# Altium schematic sheet LED_Monitor.SchDoc: LED Monitor
size Tabloid; Date: 12/20/2022; Engineer: Terry D. Schevker; Revision: 1.0; SheetNumber: 2; SheetTotal: 4
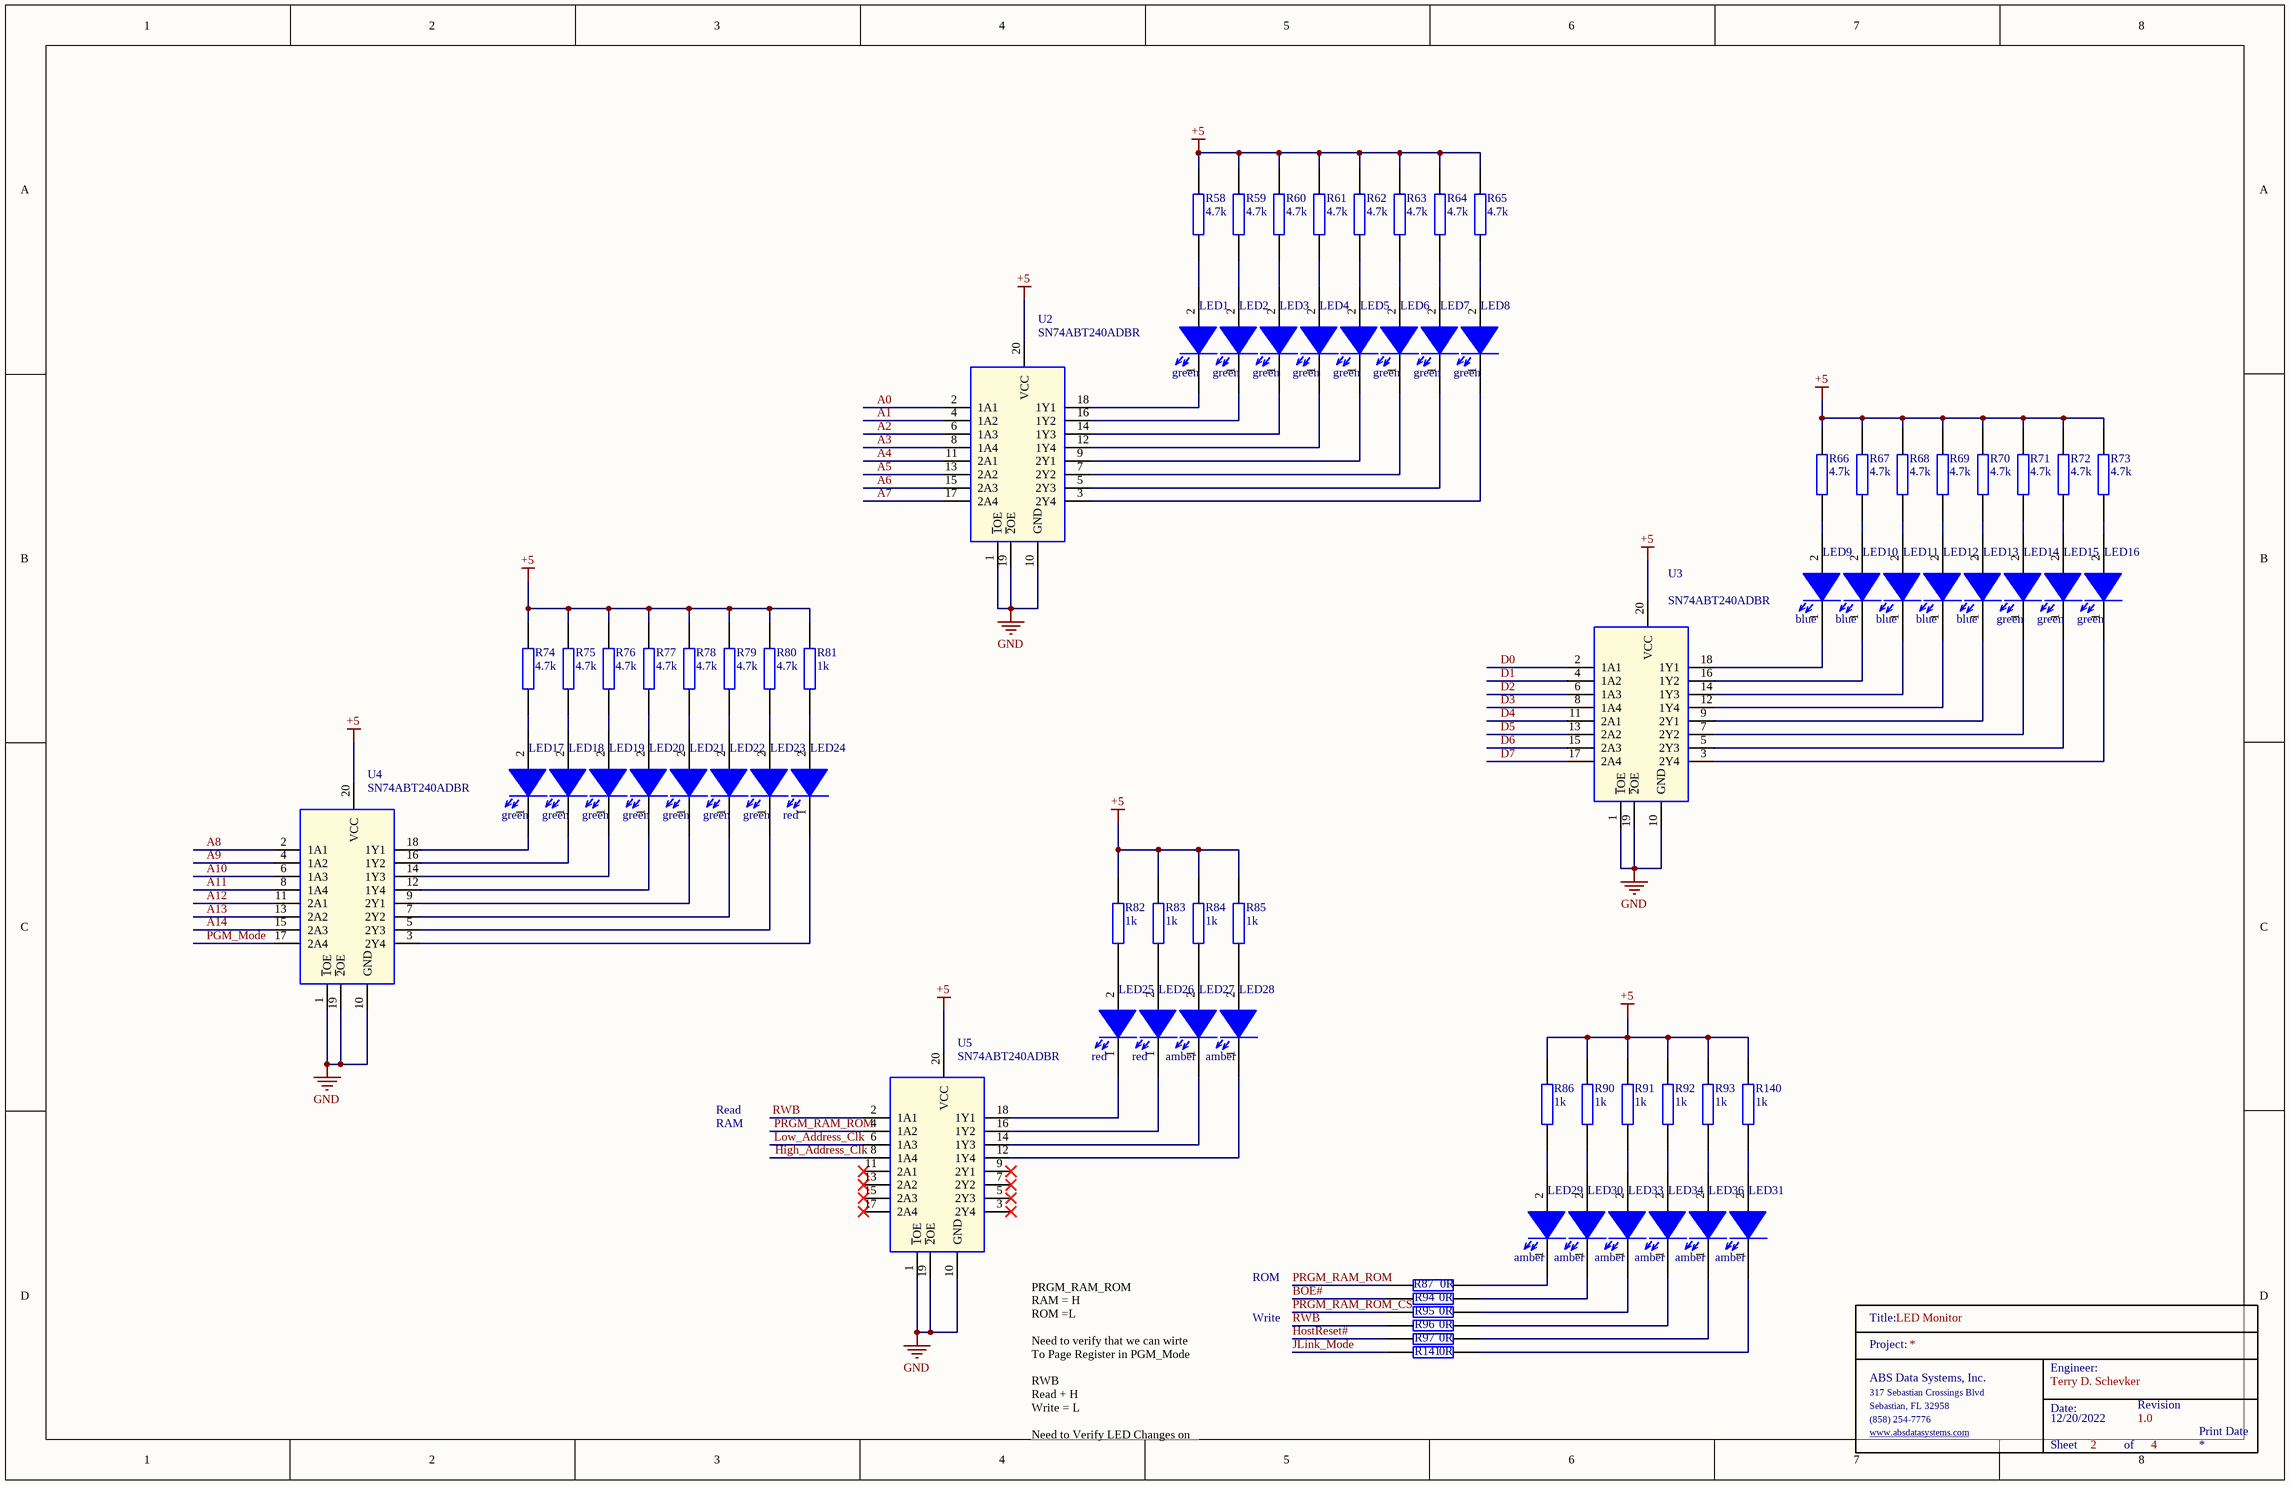
[diagram p0: LED_Monitor.SchDoc]

## Parts
LED1  green  [0603_Diode]
LED2  green  [0603_Diode]
LED3  green  [0603_Diode]
LED4  green  [0603_Diode]
LED5  green  [0603_Diode]
LED6  green  [0603_Diode]
LED7  green  [0603_Diode]
LED8  green  [0603_Diode]
LED9  blue  [0603_Diode]
LED10  blue  [0603_Diode]
LED11  blue  [0603_Diode]
LED12  blue  [0603_Diode]
LED13  blue  [0603_Diode]
LED14  green  [0603_Diode]
LED15  green  [0603_Diode]
LED16  green  [0603_Diode]
LED17  green  [0603_Diode]
LED18  green  [0603_Diode]
LED19  green  [0603_Diode]
LED20  green  [0603_Diode]
LED21  green  [0603_Diode]
LED22  green  [0603_Diode]
LED23  green  [0603_Diode]
LED24  red  [0603_Diode]
LED25  red  [0603_Diode]
LED26  red  [0603_Diode]
LED27  amber  [0603_Diode]
LED28  amber  [0603_Diode]
LED29  amber  [0603_Diode]
LED30  amber  [0603_Diode]
LED31  amber  [0603_Diode]
LED33  amber  [0603_Diode]
LED34  amber  [0603_Diode]
LED36  amber  [0603_Diode]
R58  4.7k  [0603]
R59  4.7k  [0603]
R60  4.7k  [0603]
R61  4.7k  [0603]
R62  4.7k  [0603]
R63  4.7k  [0603]
R64  4.7k  [0603]
R65  4.7k  [0603]
R66  4.7k  [0603]
R67  4.7k  [0603]
R68  4.7k  [0603]
R69  4.7k  [0603]
R70  4.7k  [0603]
R71  4.7k  [0603]
R72  4.7k  [0603]
R73  4.7k  [0603]
R74  4.7k  [0603]
R75  4.7k  [0603]
R76  4.7k  [0603]
R77  4.7k  [0603]
R78  4.7k  [0603]
R79  4.7k  [0603]
R80  4.7k  [0603]
R81  1k  [0603]
R82  1k  [0603]
R83  1k  [0603]
R84  1k  [0603]
R85  1k  [0603]
R86  1k  [0603]
R87  0R  [0603]
R90  1k  [0603]
R91  1k  [0603]
R92  1k  [0603]
R93  1k  [0603]
R94  0R  [0603]
R95  0R  [0603]
R96  0R  [0603]
R97  0R  [0603]
R140  1k  [0603]
R141  0R  [0603]
TitleBlock_1  TitleBlock  (value not drawn)  (graphical)
U2  SN74ABT240ADBR  [SOP65P780X200-20N]
U3  SN74ABT240ADBR  [SOP65P780X200-20N]
U4  SN74ABT240ADBR  [SOP65P780X200-20N]
U5  SN74ABT240ADBR  [SOP65P780X200-20N]

## Nets
+5: R58.2 R59.2 R60.2 R61.2 R62.2 R63.2 R64.2 R65.2 R66.2 R67.2 R68.2 R69.2 R70.2 R71.2 R72.2 R73.2 R74.2 R75.2 R76.2 R77.2 R78.2 R79.2 R80.2 R81.2 R82.2 R83.2 R84.2 R85.2 R86.2 R90.2 R91.2 R92.2 R93.2 R140.2 U2.20(VCC) U3.20(VCC) U4.20(VCC) U5.20(VCC)
GND: U2.1(~{1}OE) U2.10(GND) U2.19(~{2}OE) U3.1(~{1}OE) U3.10(GND) U3.19(~{2}OE) U4.1(~{1}OE) U4.10(GND) U4.19(~{2}OE) U5.1(~{1}OE) U5.10(GND) U5.19(~{2}OE)
A0: U2.2(1A1)
A1: U2.4(1A2)
A2: U2.6(1A3)
A3: U2.8(1A4)
A4: U2.11(2A1)
A5: U2.13(2A2)
A6: U2.15(2A3)
A7: U2.17(2A4)
A8: U4.2(1A1)
A9: U4.4(1A2)
A10: U4.6(1A3)
A11: U4.8(1A4)
A12: U4.11(2A1)
A13: U4.13(2A2)
A14: U4.15(2A3)
BOE#: R94.1
D0: U3.2(1A1)
D1: U3.4(1A2)
D2: U3.6(1A3)
D3: U3.8(1A4)
D4: U3.11(2A1)
D5: U3.13(2A2)
D6: U3.15(2A3)
D7: U3.17(2A4)
High_Address_Clk: U5.8(1A4)
HostReset#: R97.1
JLink_Mode: R141.1
Low_Address_Clk: U5.6(1A3)
PGM_Mode: U4.17(2A4)
PRGM_RAM_ROM: R87.1 U5.4(1A2)
PRGM_RAM_ROM_CS: R95.1
RWB: R96.1 U5.2(1A1)
NetLED1_1: LED1.1(K) U2.18(1Y1)
NetLED1_2: LED1.2(A) R58.1
NetLED2_1: LED2.1(K) U2.16(1Y2)
NetLED2_2: LED2.2(A) R59.1
NetLED3_1: LED3.1(K) U2.14(1Y3)
NetLED3_2: LED3.2(A) R60.1
NetLED4_1: LED4.1(K) U2.12(1Y4)
NetLED4_2: LED4.2(A) R61.1
NetLED5_1: LED5.1(K) U2.9(2Y1)
NetLED5_2: LED5.2(A) R62.1
NetLED6_1: LED6.1(K) U2.7(2Y2)
NetLED6_2: LED6.2(A) R63.1
NetLED7_1: LED7.1(K) U2.5(2Y3)
NetLED7_2: LED7.2(A) R64.1
NetLED8_1: LED8.1(K) U2.3(2Y4)
NetLED8_2: LED8.2(A) R65.1
NetLED9_1: LED9.1(K) U3.18(1Y1)
NetLED9_2: LED9.2(A) R66.1
NetLED10_1: LED10.1(K) U3.16(1Y2)
NetLED10_2: LED10.2(A) R67.1
NetLED11_1: LED11.1(K) U3.14(1Y3)
NetLED11_2: LED11.2(A) R68.1
NetLED12_1: LED12.1(K) U3.12(1Y4)
NetLED12_2: LED12.2(A) R69.1
NetLED13_1: LED13.1(K) U3.9(2Y1)
NetLED13_2: LED13.2(A) R70.1
NetLED14_1: LED14.1(K) U3.7(2Y2)
NetLED14_2: LED14.2(A) R71.1
NetLED15_1: LED15.1(K) U3.5(2Y3)
NetLED15_2: LED15.2(A) R72.1
NetLED16_1: LED16.1(K) U3.3(2Y4)
NetLED16_2: LED16.2(A) R73.1
NetLED17_1: LED17.1(K) U4.18(1Y1)
NetLED17_2: LED17.2(A) R74.1
NetLED18_1: LED18.1(K) U4.16(1Y2)
NetLED18_2: LED18.2(A) R75.1
NetLED19_1: LED19.1(K) U4.14(1Y3)
NetLED19_2: LED19.2(A) R76.1
NetLED20_1: LED20.1(K) U4.12(1Y4)
NetLED20_2: LED20.2(A) R77.1
NetLED21_1: LED21.1(K) U4.9(2Y1)
NetLED21_2: LED21.2(A) R78.1
NetLED22_1: LED22.1(K) U4.7(2Y2)
NetLED22_2: LED22.2(A) R79.1
NetLED23_1: LED23.1(K) U4.5(2Y3)
NetLED23_2: LED23.2(A) R80.1
NetLED24_1: LED24.1(K) U4.3(2Y4)
NetLED24_2: LED24.2(A) R81.1
NetLED25_1: LED25.1(K) U5.18(1Y1)
NetLED25_2: LED25.2(A) R82.1
NetLED26_1: LED26.1(K) U5.16(1Y2)
NetLED26_2: LED26.2(A) R83.1
NetLED27_1: LED27.1(K) U5.14(1Y3)
NetLED27_2: LED27.2(A) R84.1
NetLED28_1: LED28.1(K) U5.12(1Y4)
NetLED28_2: LED28.2(A) R85.1
NetLED29_1: LED29.1(K) R87.2
NetLED29_2: LED29.2(A) R86.1
NetLED30_1: LED30.1(K) R94.2
NetLED30_2: LED30.2(A) R90.1
NetLED31_1: LED31.1(K) R141.2
NetLED31_2: LED31.2(A) R140.1
NetLED33_1: LED33.1(K) R95.2
NetLED33_2: LED33.2(A) R91.1
NetLED34_1: LED34.1(K) R96.2
NetLED34_2: LED34.2(A) R92.1
NetLED36_1: LED36.1(K) R97.2
NetLED36_2: LED36.2(A) R93.1

Not connected (* = marked no-connect by the designer): U5 3(2Y4)* 5(2Y3)* 7(2Y2)* 9(2Y1)* 11(2A1)* 13(2A2)* 15(2A3)* 17(2A4)*

## Notes on the sheet
- RAM
- Read
- ROM
- Write
- PRGM_RAM_ROM
  RAM = H
  ROM =L
  Need to verify that we can wirte To Page Register in PGM_Mode
  RWB
  Read + H
  Write = L
  Need to Verify LED Changes on PCB
- Print Date
- (in symbol TitleBlock) Title:; Project:; Engineer:; ABS Data Systems, Inc.; 317 Sebastian Crossings Blvd; Sebastian, FL 32958; Date:; Revision; (858) 254-7776; www.absdatasystems.com; Sheet; of

## Library data of the parts
LED1-LED8 LED14-LED23 = 150060GS75000: Wurth Elektronik 0603 green; Manufacturer: Wurth Electronics; Wavelength: 520nm; Viewing Angle: 140°; Lens Style: Clear,Rectangular; Luminous Intensity: 430mcd; Forward Current: 30mA; Forward Voltage: 3.2V; Test Current: 20mA; Supplier 1: Digi-Key; Manufacturer Part Number: 150060GS75000; RoHS: Yes; Category: LEDs; Stock 1: 71509; Pricing 1: 1=0.14000, 50=0.13300, 100=0.11400, 500=0.09900 (USD); Mount: Surface Mount; Case/Package: 0603; Color: Green; Case Code (Metric): 1608; Case Code (Imperial): 0603; Min Operating Temperature: -40°C; Max Operating Temperature: 85°C; Package Quantity: 4000; Packaging: Tape and Reel; Dominant Wavelength: 520nm; Length: 1.6mm; Width: 0.8mm; Height: 0.7mm; REACH SVHC: Unknown; Lead Free: Lead Free; ComponentLink1URL: https://datasheet.ciiva.com/29562/150060gs75000-29562868.pdf?src-supplier=Digi-Key; ComponentLink1Description: https://datasheet.ciiva.com/29562/150060gs75000-29562868.pdf?src-supplier=Digi-Key; ComponentLink2URL: https://datasheet.ciiva.com/29279/759427-da-01-en-chipled-0603-w-kl-gruen-150060gs75000-29279201.pdf?src-supplier=Conrad; ComponentLink2Description: https://datasheet.ciiva.com/29279/759427-da-01-en-chipled-0603-w-kl-gruen-150060gs75000-29279201.pdf?src-supplier=Conrad; ComponentLink3URL: https://datasheet.ciiva.com/29562/150060gs75000-29562869.pdf?src-supplier=Digi-Key; ComponentLink3Description: https://datasheet.ciiva.com/29562/150060gs75000-29562869.pdf?src-supplier=Digi-Key; ComponentLink4URL: https://datasheet.ciiva.com/29562/150060gs75000-29562870.pdf?src-supplier=Digi-Key; ComponentLink4Description: https://datasheet.ciiva.com/29562/150060gs75000-29562870.pdf?src-supplier=Digi-Key
LED9-LED13 = 150060BS75000: Wurth Elektronik 0603 blue; Manufacturer: Wurth Electronics; Manufacturer Part Number: 150060GS75000; Color: Green; Wavelength: 520nm; Viewing Angle: 140°; Lens Style: Clear,Rectangular; Luminous Intensity: 430mcd; Forward Current: 30mA; Forward Voltage: 3.2V; Test Current: 20mA; Supplier 1: Digi-Key; RoHS: Yes; Category: LEDs; Stock 1: 71509; Pricing 1: 1=0.14000, 50=0.13300, 100=0.11400, 500=0.09900 (USD); Mount: Surface Mount; Case/Package: 0603; Case Code (Metric): 1608; Case Code (Imperial): 0603; Min Operating Temperature: -40°C; Max Operating Temperature: 85°C; Package Quantity: 4000; Packaging: Tape and Reel; Dominant Wavelength: 520nm; Length: 1.6mm; Width: 0.8mm; Height: 0.7mm; REACH SVHC: Unknown; Lead Free: Lead Free; ComponentLink1URL: https://datasheet.ciiva.com/29562/150060gs75000-29562868.pdf?src-supplier=Digi-Key; ComponentLink1Description: https://datasheet.ciiva.com/29562/150060gs75000-29562868.pdf?src-supplier=Digi-Key; ComponentLink2URL: https://datasheet.ciiva.com/29279/759427-da-01-en-chipled-0603-w-kl-gruen-150060gs75000-29279201.pdf?src-supplier=Conrad; ComponentLink2Description: https://datasheet.ciiva.com/29279/759427-da-01-en-chipled-0603-w-kl-gruen-150060gs75000-29279201.pdf?src-supplier=Conrad; ComponentLink3URL: https://datasheet.ciiva.com/29562/150060gs75000-29562869.pdf?src-supplier=Digi-Key; ComponentLink3Description: https://datasheet.ciiva.com/29562/150060gs75000-29562869.pdf?src-supplier=Digi-Key; ComponentLink4URL: https://datasheet.ciiva.com/29562/150060gs75000-29562870.pdf?src-supplier=Digi-Key; ComponentLink4Description: https://datasheet.ciiva.com/29562/150060gs75000-29562870.pdf?src-supplier=Digi-Key
LED24-LED26 = 150060RS75000: Wurth Elektronik 0603 red; Manufacturer: Wurth Electronics; Manufacturer Part Number: 150060GS75000; Color: Green; Wavelength: 520nm; Viewing Angle: 140°; Lens Style: Clear,Rectangular; Luminous Intensity: 430mcd; Forward Current: 30mA; Forward Voltage: 3.2V; Test Current: 20mA; Supplier 1: Digi-Key; RoHS: Yes; Category: LEDs; Stock 1: 71509; Pricing 1: 1=0.14000, 50=0.13300, 100=0.11400, 500=0.09900 (USD); Mount: Surface Mount; Case/Package: 0603; Case Code (Metric): 1608; Case Code (Imperial): 0603; Min Operating Temperature: -40°C; Max Operating Temperature: 85°C; Package Quantity: 4000; Packaging: Tape and Reel; Dominant Wavelength: 520nm; Length: 1.6mm; Width: 0.8mm; Height: 0.7mm; REACH SVHC: Unknown; Lead Free: Lead Free; ComponentLink1URL: https://datasheet.ciiva.com/29562/150060gs75000-29562868.pdf?src-supplier=Digi-Key; ComponentLink1Description: https://datasheet.ciiva.com/29562/150060gs75000-29562868.pdf?src-supplier=Digi-Key; ComponentLink2URL: https://datasheet.ciiva.com/29279/759427-da-01-en-chipled-0603-w-kl-gruen-150060gs75000-29279201.pdf?src-supplier=Conrad; ComponentLink2Description: https://datasheet.ciiva.com/29279/759427-da-01-en-chipled-0603-w-kl-gruen-150060gs75000-29279201.pdf?src-supplier=Conrad; ComponentLink3URL: https://datasheet.ciiva.com/29562/150060gs75000-29562869.pdf?src-supplier=Digi-Key; ComponentLink3Description: https://datasheet.ciiva.com/29562/150060gs75000-29562869.pdf?src-supplier=Digi-Key; ComponentLink4URL: https://datasheet.ciiva.com/29562/150060gs75000-29562870.pdf?src-supplier=Digi-Key; ComponentLink4Description: https://datasheet.ciiva.com/29562/150060gs75000-29562870.pdf?src-supplier=Digi-Key
LED27-LED31 LED33 LED34 LED36 = 150060AS75000: Wurth Elektronik 0603 amber; Manufacturer: Wurth Electronics; Manufacturer Part Number: 150060GS75000; Color: Green; Wavelength: 520nm; Viewing Angle: 140°; Lens Style: Clear,Rectangular; Luminous Intensity: 430mcd; Forward Current: 30mA; Forward Voltage: 3.2V; Test Current: 20mA; Supplier 1: Digi-Key; RoHS: Yes; Category: LEDs; Stock 1: 71509; Pricing 1: 1=0.14000, 50=0.13300, 100=0.11400, 500=0.09900 (USD); Mount: Surface Mount; Case/Package: 0603; Case Code (Metric): 1608; Case Code (Imperial): 0603; Min Operating Temperature: -40°C; Max Operating Temperature: 85°C; Package Quantity: 4000; Packaging: Tape and Reel; Dominant Wavelength: 520nm; Length: 1.6mm; Width: 0.8mm; Height: 0.7mm; REACH SVHC: Unknown; Lead Free: Lead Free; ComponentLink1URL: https://datasheet.ciiva.com/29562/150060gs75000-29562868.pdf?src-supplier=Digi-Key; ComponentLink1Description: https://datasheet.ciiva.com/29562/150060gs75000-29562868.pdf?src-supplier=Digi-Key; ComponentLink2URL: https://datasheet.ciiva.com/29279/759427-da-01-en-chipled-0603-w-kl-gruen-150060gs75000-29279201.pdf?src-supplier=Conrad; ComponentLink2Description: https://datasheet.ciiva.com/29279/759427-da-01-en-chipled-0603-w-kl-gruen-150060gs75000-29279201.pdf?src-supplier=Conrad; ComponentLink3URL: https://datasheet.ciiva.com/29562/150060gs75000-29562869.pdf?src-supplier=Digi-Key; ComponentLink3Description: https://datasheet.ciiva.com/29562/150060gs75000-29562869.pdf?src-supplier=Digi-Key; ComponentLink4URL: https://datasheet.ciiva.com/29562/150060gs75000-29562870.pdf?src-supplier=Digi-Key; ComponentLink4Description: https://datasheet.ciiva.com/29562/150060gs75000-29562870.pdf?src-supplier=Digi-Key
R58-R80 = RC0603FR-104K7L: YAGEO 0603 4.7k; Manufacturer_Name: KEMET; Manufacturer_Part_Number: RC0603JR-070RL; Geometry.Height: 0.55mm; Mouser Part Number: 603-RC0603JR-070RL; Mouser Price/Stock: https://www.mouser.co.uk/ProductDetail/YAGEO/RC0603JR-070RL?qs=2cAdsCoAWRGWyPcuXgGiXQ%3D%3D; Datasheet Link: https://datasheet.datasheetarchive.com/originals/distributors/Datasheets_SAMA/902f9e387b938f871d31120f5fc1d65e.pdf
R81-R86 R90-R93 R140 = AC0603FR-7W1KL_1: YAGEO 0603 1k ohm; Manufacturer_Name: KEMET; Manufacturer_Part_Number: RC0603JR-070RL; Geometry.Height: 0.55mm; Mouser Part Number: 603-RC0603JR-070RL; Mouser Price/Stock: https://www.mouser.co.uk/ProductDetail/YAGEO/RC0603JR-070RL?qs=2cAdsCoAWRGWyPcuXgGiXQ%3D%3D; Datasheet Link: https://datasheet.datasheetarchive.com/originals/distributors/Datasheets_SAMA/902f9e387b938f871d31120f5fc1d65e.pdf
R87 R94-R97 R141 = RC0603JR-070RL: YAGEO 0603 0 ohm; Manufacturer_Name: KEMET; Geometry.Height: 0.55mm; Mouser Part Number: 603-RC0603JR-070RL; Mouser Price/Stock: https://www.mouser.co.uk/ProductDetail/YAGEO/RC0603JR-070RL?qs=2cAdsCoAWRGWyPcuXgGiXQ%3D%3D; Manufacturer_Part_Number: RC0603JR-070RL; Datasheet Link: https://datasheet.datasheetarchive.com/originals/distributors/Datasheets_SAMA/902f9e387b938f871d31120f5fc1d65e.pdf
U2-U5 = SN74ABT240ADBR: Octal Buffers/Drivers With 3-State Outputs; Manufacturer_Name: Texas Instruments; Geometry.Height: 2mm; Mouser Part Number: 595-SN74ABT240ADBR; Mouser Price/Stock: https://www.mouser.co.uk/ProductDetail/Texas-Instruments/SN74ABT240ADBR?qs=JHHQeKcAU3Dt82k%252BVyiYdw%3D%3D; Manufacturer_Part_Number: SN74ABT240ADBR; Datasheet Link: http://www.ti.com/lit/gpn/sn74abt240a